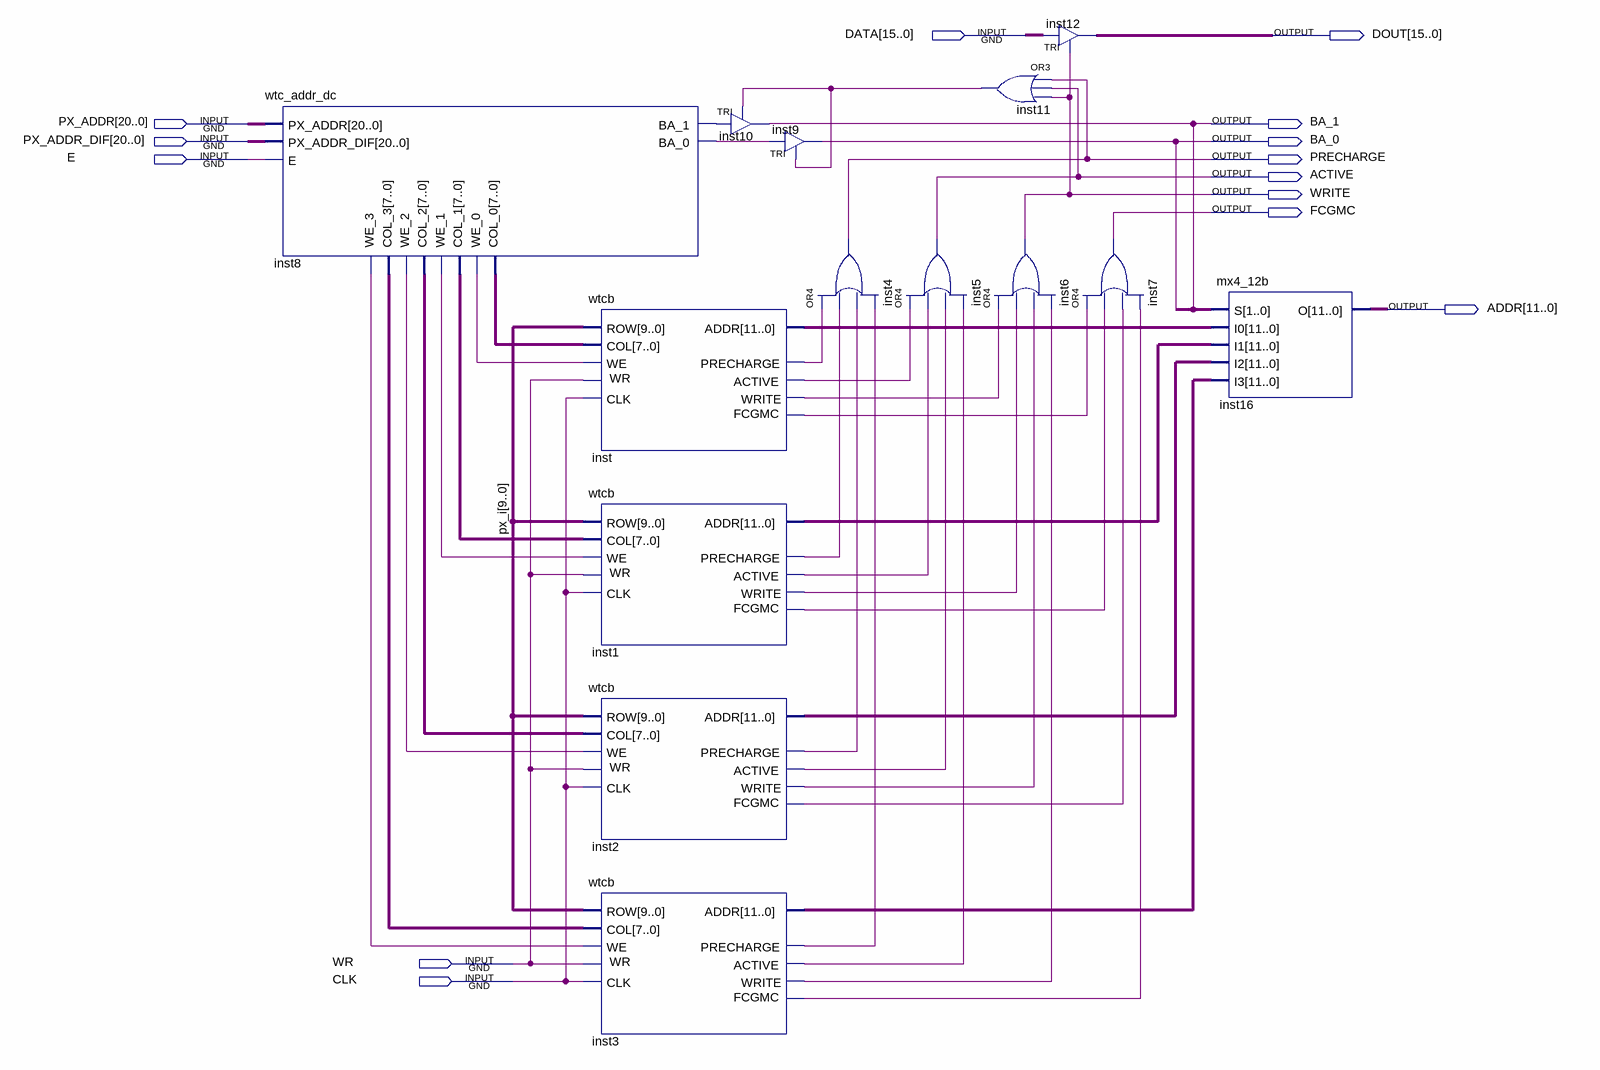
[diagram p0: schematic sheet]
// Quartus schematic wtc.bdf as structural Verilog: 14 symbols, 14 pins
module wtc (
  input  [15:0] DATA,
  input  [20:0] PX_ADDR,
  input  [20:0] PX_ADDR_DIF,
  input  E,
  input  WR,
  input  CLK,
  output [15:0] DOUT,
  output BA_1,
  output BA_0,
  output PRECHARGE,
  output ACTIVE,
  output WRITE,
  output FCGMC,
  output [11:0] ADDR
);

  wire inst1_active, inst1_fcgmc, inst1_precharge, inst1_write, inst2_active, inst2_fcgmc, inst2_precharge,
       inst2_write, inst3_active, inst3_fcgmc, inst3_precharge, inst3_write, inst8_ba_0, inst8_ba_1,
       inst8_we_0, inst8_we_1, inst8_we_2, inst8_we_3, inst11_out, inst_active, inst_fcgmc, inst_precharge,
       inst_write;
  wire [7:0] inst8_col_0, inst8_col_1, inst8_col_2, inst8_col_3;
  wire [11:0] inst1_addr, inst2_addr, inst3_addr, inst_addr;

  wtc_addr_dc inst8 (
    .PX_ADDR(PX_ADDR), .PX_ADDR_DIF(PX_ADDR_DIF), .E(E), .BA_1(inst8_ba_1), .BA_0(inst8_ba_0),
    .COL_0(inst8_col_0), .COL_1(inst8_col_1), .COL_2(inst8_col_2), .COL_3(inst8_col_3), .WE_0(inst8_we_0),
    .WE_1(inst8_we_1), .WE_2(inst8_we_2), .WE_3(inst8_we_3));
  wtcb inst (
    .ROW(PX_ADDR[20:11]), .COL(inst8_col_0), .WE(inst8_we_0), .CLK(CLK), .WR(WR), .ADDR(inst_addr),
    .PRECHARGE(inst_precharge), .ACTIVE(inst_active), .WRITE(inst_write), .FCGMC(inst_fcgmc));
  wtcb inst1 (
    .ROW(PX_ADDR[20:11]), .COL(inst8_col_1), .WE(inst8_we_1), .CLK(CLK), .WR(WR), .ADDR(inst1_addr),
    .PRECHARGE(inst1_precharge), .ACTIVE(inst1_active), .WRITE(inst1_write), .FCGMC(inst1_fcgmc));
  wtcb inst2 (
    .ROW(PX_ADDR[20:11]), .COL(inst8_col_2), .WE(inst8_we_2), .CLK(CLK), .WR(WR), .ADDR(inst2_addr),
    .PRECHARGE(inst2_precharge), .ACTIVE(inst2_active), .WRITE(inst2_write), .FCGMC(inst2_fcgmc));
  wtcb inst3 (
    .ROW(PX_ADDR[20:11]), .COL(inst8_col_3), .WE(inst8_we_3), .CLK(CLK), .WR(WR), .ADDR(inst3_addr),
    .PRECHARGE(inst3_precharge), .ACTIVE(inst3_active), .WRITE(inst3_write), .FCGMC(inst3_fcgmc));
  TRI inst10 (.IN(inst8_ba_1), .OE(inst11_out), .OUT(BA_1));
  TRI inst9 (.IN(inst8_ba_0), .OE(inst11_out), .OUT(BA_0));
  or inst4 (PRECHARGE, inst_precharge, inst1_precharge, inst2_precharge, inst3_precharge);
  or inst5 (ACTIVE, inst_active, inst1_active, inst2_active, inst3_active);
  or inst11 (inst11_out, PRECHARGE, ACTIVE, WRITE);
  or inst6 (WRITE, inst_write, inst1_write, inst2_write, inst3_write);
  TRI inst12[15:0] (.IN(DATA), .OE(WRITE), .OUT(DOUT));
  or inst7 (FCGMC, inst_fcgmc, inst1_fcgmc, inst2_fcgmc, inst3_fcgmc);
  mx4_12b inst16 (.S({BA_1, BA_0}), .I0(inst_addr), .I1(inst1_addr), .I2(inst2_addr), .I3(inst3_addr), .O(ADDR));

  // Other names for the same wires on the sheet: s[1:0] = {BA_1, BA_0}; px_i[9:0] = PX_ADDR[20:11];
  //   px_j[10:0] = PX_ADDR[10:0]
endmodule
